# Altium schematic sheet regulators.SchDoc
size B
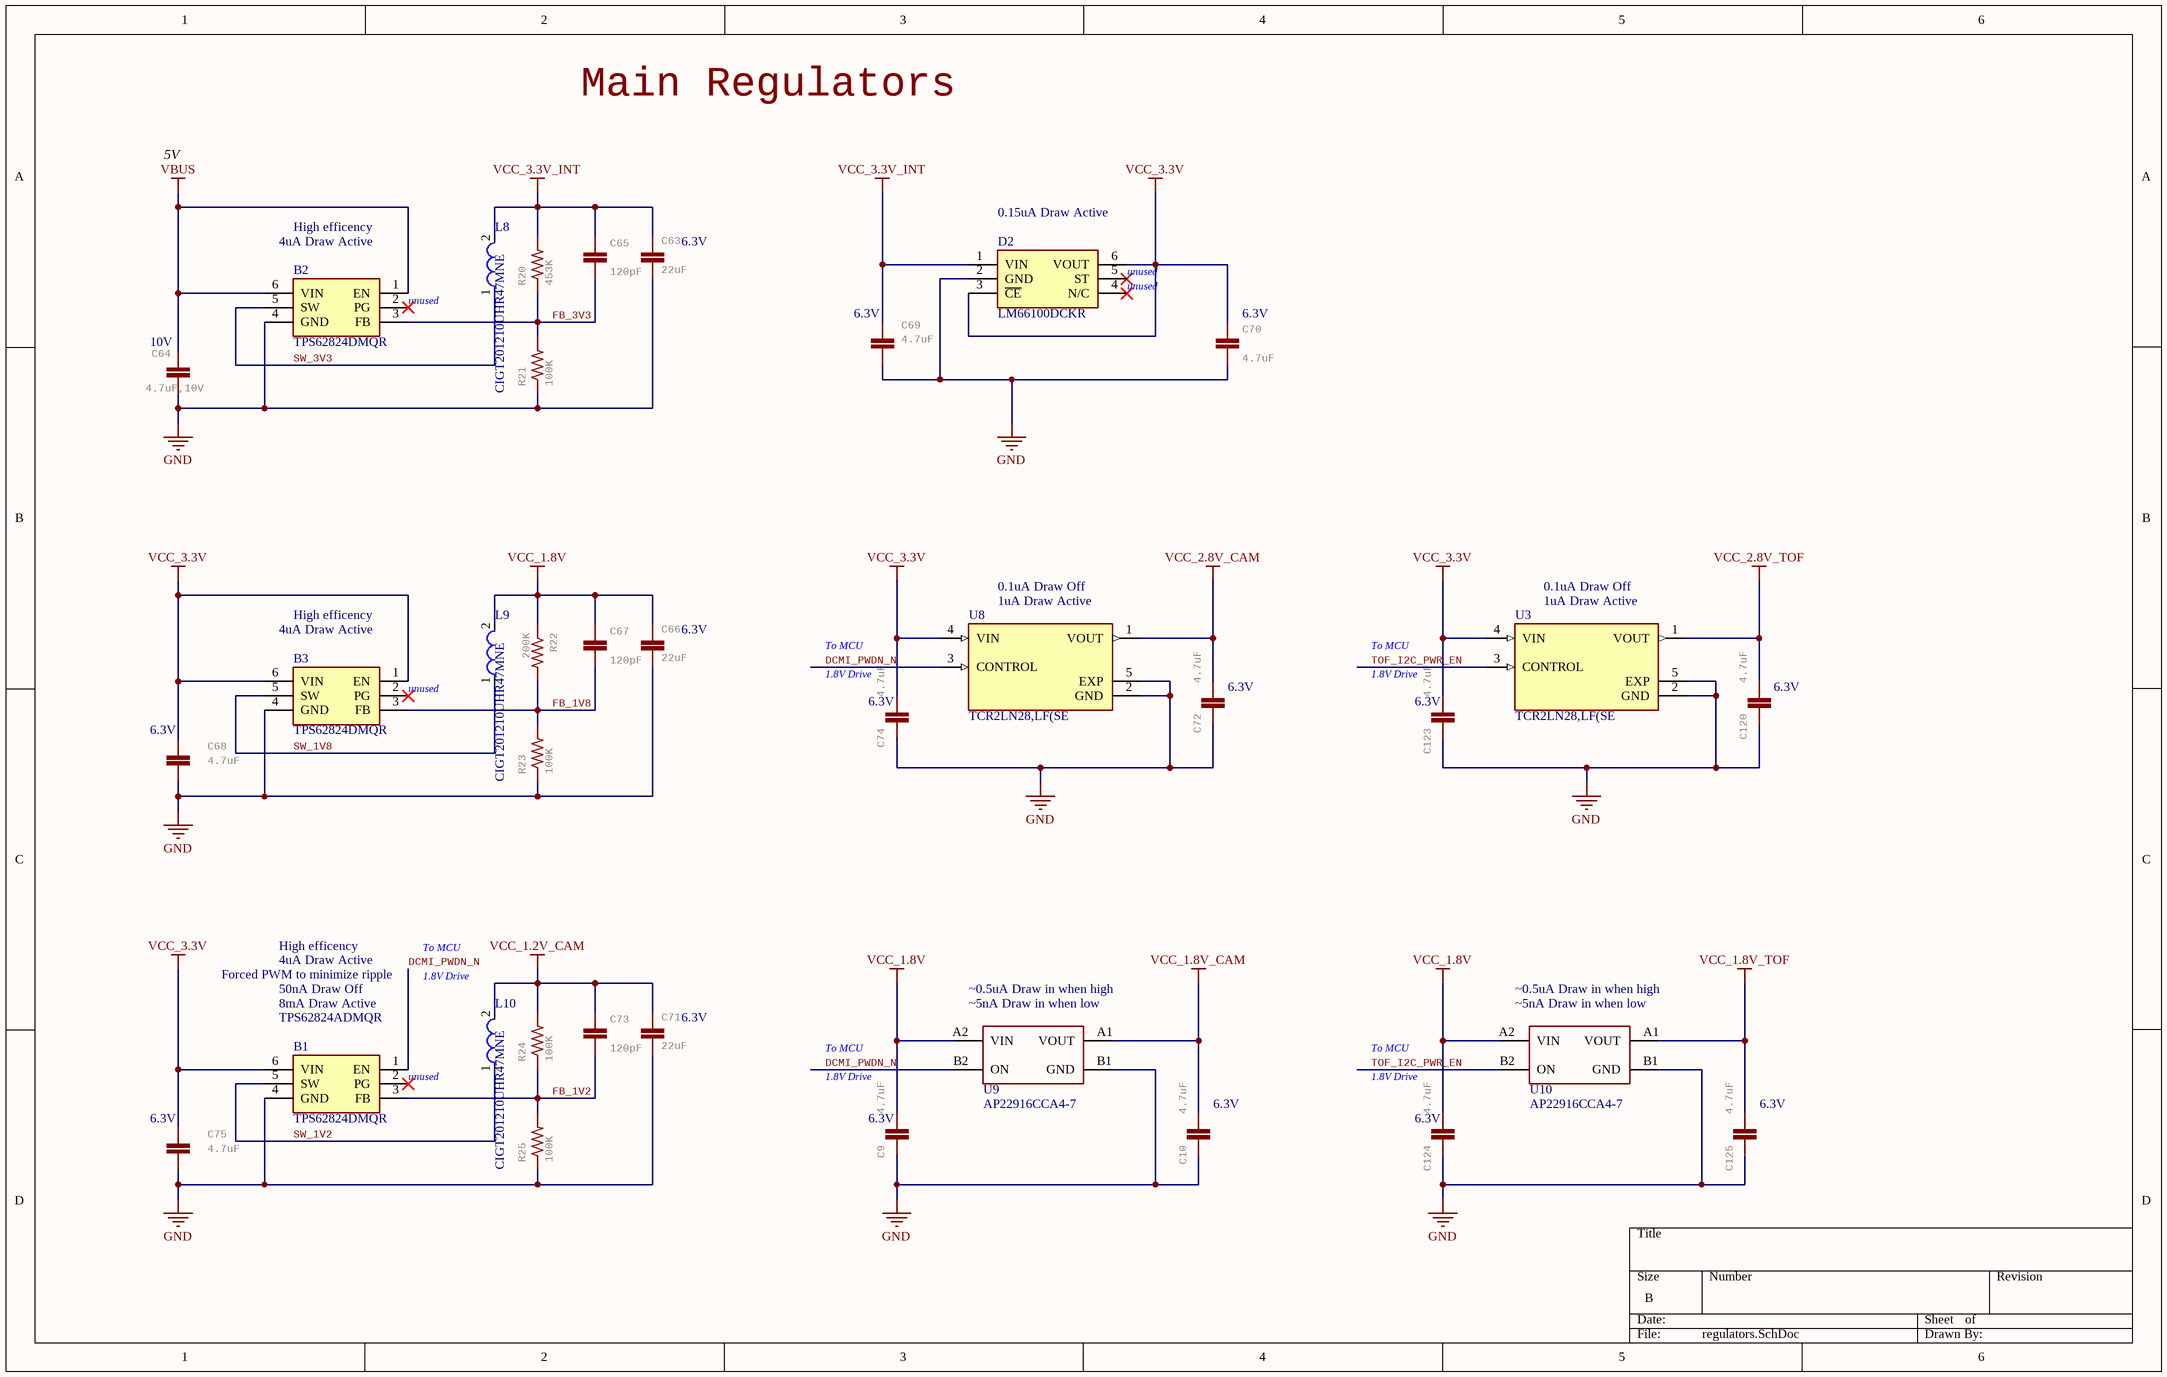
[diagram p0: regulators.SchDoc]

## Parts
B1  TPS62824DMQR  [TPS62826ADMQR]
B2  TPS62824DMQR  [TPS62826ADMQR]
B3  TPS62824DMQR  [TPS62826ADMQR]
C9  4.7uF  [0402-CAP]
C10  4.7uF  [0402-CAP]
C63  22uF  [0805]
C64  4.7uF,10V  [0402-CAP]
C65  120pF  [C0201]
C66  22uF  [0805]
C67  120pF  [C0201]
C68  4.7uF  [0402-CAP]
C69  4.7uF  [0402-CAP]
C70  4.7uF  [0402-CAP]
C71  22uF  [0805]
C72  4.7uF  [0402-CAP]
C73  120pF  [C0201]
C74  4.7uF  [0402-CAP]
C75  4.7uF  [0402-CAP]
C120  4.7uF  [0402-CAP]
C123  4.7uF  [0402-CAP]
C124  4.7uF  [0402-CAP]
C125  4.7uF  [0402-CAP]
D2  LM66100DCKR  [SOP65P210X110-6N]
L8  CIGT201210UHR47MNE  [0805]
L9  CIGT201210UHR47MNE  [0805]
L10  CIGT201210UHR47MNE  [0805]
R20  453K  [R0201]
R21  100K  [R0201]
R22  200K  [R0201]
R23  100K  [R0201]
R24  100K  [R0201]
R25  100K  [R0201]
U3  TCR2LN28,LF(SE  [VREG_TCR2LN30_LF]
U8  TCR2LN28,LF(SE  [VREG_TCR2LN30_LF]
U9  PMOS Load Switch  [AP22916CCA4-7]  (value not drawn)
U10  PMOS Load Switch  [AP22916CCA4-7]  (value not drawn)

## Nets
GND: B1.4(GND) B2.4(GND) B3.4(GND) C9.1 C10.1 C63.2 C64.2 C66.2 C68.1 C69.1 C70.1 C71.2 C72.1 C74.1 C75.1 C120.1 C123.1 C124.1 C125.1 D2.2(GND) R21.1 R23.1 R25.1 U3.2(GND) U3.5(EXP) U8.2(GND) U8.5(EXP) U9.B1(GND) U10.B1(GND)
VBUS: B2.1(EN) B2.6(VIN) C64.1
VCC_1.2V_CAM: C71.1 C73.2 L10.2 R24.2
VCC_1.8V: C9.2 C66.1 C67.2 C124.2 L9.2 R22.1 U9.A2(VIN) U10.A2(VIN)
VCC_1.8V_CAM: C10.2 U9.A1(VOUT)
VCC_1.8V_TOF: C125.2 U10.A1(VOUT)
VCC_2.8V_CAM: C72.2 U8.1(VOUT)
VCC_2.8V_TOF: C120.2 U3.1(VOUT)
VCC_3.3V: B1.6(VIN) B3.1(EN) B3.6(VIN) C68.2 C70.2 C74.2 C75.2 C123.2 D2.3(~{CE}) D2.6(VOUT) U3.4(VIN) U8.4(VIN)
VCC_3.3V_INT: C63.1 C65.2 C69.2 D2.1(VIN) L8.2 R20.2
DCMI_PWDN_N: B1.1(EN) U8.3(CONTROL) U9.B2(ON)
FB_1V2: B1.3(FB) C73.1 R24.1 R25.2
FB_1V8: B3.3(FB) C67.1 R22.2 R23.2
FB_3V3: B2.3(FB) C65.1 R20.1 R21.2
SW_1V2: B1.5(SW) L10.1
SW_1V8: B3.5(SW) L9.1
SW_3V3: B2.5(SW) L8.1
TOF_I2C_PWR_EN: U3.3(CONTROL) U10.B2(ON)

Not connected (* = marked no-connect by the designer): B1 2(PG)*; B2 2(PG)*; B3 2(PG)*; D2 4(N/C)* 5(ST)*

## Notes on the sheet
- Main Regulators
- 5V
- (near B2) 4uA Draw Active
- High efficency
- (near C63) 6.3V
- (near D2) 0.15uA Draw Active
- (near B2) unused
- (near C69) 6.3V
- (near D2) unused
- (near C70) 6.3V
- (near C64) 10V
- (near U8) 1uA Draw Active
- (near U8) 0.1uA Draw Off
- (near U3) 1uA Draw Active
- (near U3) 0.1uA Draw Off
- (near B3) 4uA Draw Active
- (near C66) 6.3V
- To MCU
- (near C74) 1.8V Drive
- (near C123) 1.8V Drive
- (near C68) 6.3V
- (near B3) unused
- (near C74) 6.3V
- (near C72) 6.3V
- (near C123) 6.3V
- (near C120) 6.3V
- 4uA Draw Active
- Forced PWM to minimize ripple
- 8mA Draw Active
- 50nA Draw Off
- (near B1) TPS62824ADMQR
- (near L10) 1.8V Drive
- (near C71) 6.3V
- (near U9) ~5nA Draw in when low
- (near U9) ~0.5uA Draw in when high
- (near U10) ~5nA Draw in when low
- (near U10) ~0.5uA Draw in when high
- (near B1) unused
- (near C9) 1.8V Drive
- (near C10) 6.3V
- (near C124) 1.8V Drive
- (near C125) 6.3V
- (near C75) 6.3V
- (near C9) 6.3V
- (near C124) 6.3V

## Library data of the parts
B1 B3 = TPS62826ADMQR: Switching Voltage Regulators 2.4-V to 5.5-V input, 1-A step-down converter in 1.5-mm 1.5-mm QFN package; Manufacturer_Name: Texas Instruments; Geometry.Height: 1mm; Mouser Part Number: 595-TPS62824DMQR; Mouser Price/Stock: https://www.mouser.co.uk/ProductDetail/Texas-Instruments/TPS62826ADMQR?qs=KUoIvG%2F9Ila3pPUbedlDEw%3D%3D; Manufacturer_Part_Number: TPS62824DMQR; Datasheet Link: https://www.ti.com/lit/ds/symlink/tps62825a.pdf?ts=1608196934558&ref_url=https%253A%252F%252Fwww.ti.com%252Fstore%252Fti%252Fen%252Fp%252Fproduct%252F%253Fp%253DTPS62825ADMQR%2526keyMatch%253DTPS62825ADMQR%2526tisearch%253DSearch-EN-everything%2526usecase; MPN: TPS62824DMQR; Part Number: TPS62824DMQR
B2 = TPS62826ADMQR: Switching Voltage Regulators 2.4-V to 5.5-V input, 3-A step-down converter with in 1.5-mm 1.5-mm QFN package; Manufacturer_Name: Texas Instruments; Manufacturer_Part_Number: TPS62826DMQR; Geometry.Height: 1mm; Mouser Part Number: 595-TPS62826DMQR; Mouser Price/Stock: https://www.mouser.co.uk/ProductDetail/Texas-Instruments/TPS62826ADMQR?qs=KUoIvG%2F9Ila3pPUbedlDEw%3D%3D; Datasheet Link: https://www.ti.com/lit/ds/symlink/tps62825a.pdf?ts=1608196934558&ref_url=https%253A%252F%252Fwww.ti.com%252Fstore%252Fti%252Fen%252Fp%252Fproduct%252F%253Fp%253DTPS62825ADMQR%2526keyMatch%253DTPS62825ADMQR%2526tisearch%253DSearch-EN-everything%2526usecase; MPN: TPS62824DMQR; Part Number: TPS62824DMQR
C9 C10 C72 C74 C120 C123-C125 = CAP_0402: 0402 (1005 Metric) Nick Garner - TeleSense; MPN: JMK105BBJ475MV-F; GateName_1: G$1; SymbolName_1: CAP; LibraryName: 0402; DeviceSetName: CAP_0402
C63 C66 C71 = 22UF-0805-6.3V-20%: 22ÂµF ceramic capacitors    A capacitor is a passive two-terminal electrical component used to store electrical energy temporarily in an electric field.; MPN: CL21A226MQQNNNE; GateName_1: G$1; SymbolName_1: CAP; PROD_ID: CAP-08402; DeviceName: -0805-6.3V-20%; LibraryName: SparkFun-Capacitors; DeviceSetName: 22UF; Part Number: CL21A226MQQNNNE
C64 = CAP0402-CAP: CapacitorStandard 0603 ceramic capacitor, and 0.1" leaded capacitor.; MPN: CL05A475MP5NRNC; GateName_1: G$1; SymbolName_1: CAP; DeviceName: 0402-CAP; LibraryName: sfe; DeviceSetName: CAP; Part Number: CL05A475MP5NRNC
C65 C67 C73 = CAP0402-CAP: MPN: GRM033R71H121KA12D; GateName_1: G$1; SymbolName_1: CAP; LibraryName: sfe; DeviceSetName: CAP; Part Number: GRM033R71H121KA12D
C68-C70 C75 = CAP0402-CAP: CapacitorStandard 0603 ceramic capacitor, and 0.1" leaded capacitor.; MPN: JMK105BBJ475MV-F; GateName_1: G$1; SymbolName_1: CAP; DeviceName: 0402-CAP; LibraryName: sfe; DeviceSetName: CAP; Part Number: JMK105BBJ475MV-F
D2 = LM66100DCKR: Diode; Manufacturer_Name: Texas Instruments; Manufacturer_Part_Number: c; Datasheet Link: http://www.ti.com/lit/gpn/LM66100; Height: 1.1mm; Mouser Part Number: 595-LM66100DCKR; Mouser Price/Stock: https://www.mouser.co.uk/ProductDetail/Texas-Instruments/LM66100DCKR?qs=vLWxofP3U2y2yPPrXoBBoA%3D%3D; Arrow Part Number: LM66100DCKR; Arrow Price/Stock: null?region=nac; MPN: LM66100DCKR; Part Number: LM66100DCKR
L8-L10 = CMP-00002-1: Power Inductor : LxW size(mm) 2012 Thickness1 Inductance (uH) 20%: 0.47; Current Rating: 3.6A; Shielding: Unshielded; Test Frequency: 1MHz; DC Resistance (DCR): 31mR; Saturation Current: 5.4A; Core Material: Metal,Composite; Value: 470nH; Tolerance: 20%; Packaging: Cut Tape; Case Code (Imperial): 0805; Case/Package: 0805; RoHS Compliant: Yes; Max Operating Temperature: 125°C; Series: CIGT; Min Operating Temperature: -40°C; Mounting Technology: Surface Mount; Case Code (Metric): 2012; MPN: CIGT201210UHR47MNE; Part Number: CIGT201210UHR47MNE
R20 = RESISTOR0402-RES: MPN: ERJ-1GNF4533C; GateName_1: G$1; SymbolName_1: RESISTOR; LibraryName: sfe; DeviceSetName: RESISTOR; Part Number: ERJ-1GNF4533C
R21 R23-R25 = RESISTOR0402-RES: MPN: RMCF0201FT100K; GateName_1: G$1; SymbolName_1: RESISTOR; LibraryName: sfe; DeviceSetName: RESISTOR; Part Number: RMCF0201FT100K
R22 = RESISTOR0402-RES: MPN: RC0201JR-07200KL; GateName_1: G$1; SymbolName_1: RESISTOR; LibraryName: sfe; DeviceSetName: RESISTOR; Part Number: RC0201JR-07200KL
U3 U8 = CMP-079-000000-1: Linear Voltage Regulator IC Positive Fixed 1 Output 200mA 4-SDFN (0.8x0.8); MF: Toshiba Semiconductor; Component Type: Standard; Availability: In Stock; Value: *; Price: None; Design Item ID: TCR2LN28,LF(SE; MP: TCR2LN28,LF(SE; Package: XFDFN-4 Toshiba; Source: TCR2LN30_LF.SchLib; Pin Count: 5; MPN: TCR2LN28,LF(SE; Part Number: TCR2LN28,LF(SE
U9 U10 = AP22916CCA4-7: MF: Diodes Inc; MPN: AP22916CCA4-7; Part Number: AP22916CCA4-7